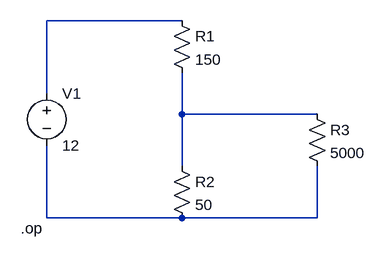
[diagram p0: schematic circuit.asc]
circuit.asc, the LTspice schematic file:
Version 4.1
SHEET 1 880 680
WIRE 320 0 112 0
WIRE 112 112 112 0
WIRE 320 144 320 80
WIRE 528 144 320 144
WIRE 320 224 320 144
WIRE 112 304 112 192
WIRE 320 304 112 304
WIRE 528 304 528 224
WIRE 528 304 320 304
DATAFLAG 208 -16 ""
DATAFLAG 256 16 ""
DATAFLAG 224 0 ""
DATAFLAG 320 96 ""
DATAFLAG 224 304 ""
DATAFLAG 528 256 ""
SYMBOL voltage 112 96 R0
SYMATTR InstName V1
SYMATTR Value 12
SYMBOL res 304 -16 R0
SYMATTR InstName R1
SYMATTR Value 150
SYMBOL res 304 208 R0
SYMATTR InstName R2
SYMATTR Value 50
SYMBOL res 512 128 R0
SYMATTR InstName R3
SYMATTR Value 5000
TEXT 72 320 Left 2 !.op

The netlist it stands for:
* circuit.asc
V1 N001 N003 12
R1 N001 N002 150
R2 N002 N003 50
R3 N002 N003 5000
.op
.backanno
.end